# Altium schematic sheet LED.SchDoc
size A; SheetNumber: 1; SheetTotal: 1
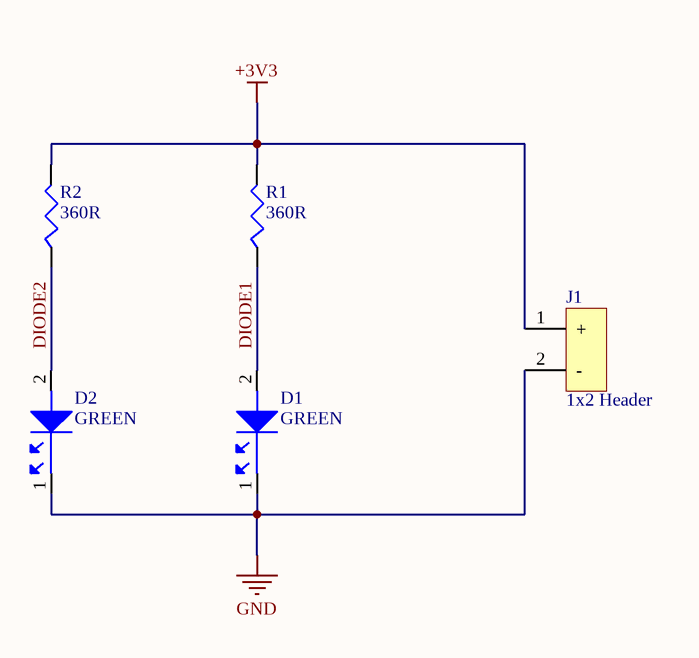
[diagram p0: LED.SchDoc]

## Parts
D1  GREEN  [LED0603G]
D2  GREEN  [LED0603G]
J1  1x2 Header  [HDR1X2]
R1  360R  [R0805]
R2  360R  [R0805]

## Nets
+3V3: J1.1(+) R1.2 R2.2
GND: D1.1 D2.1 J1.2(-)
DIODE1: D1.2 R1.1
DIODE2: D2.2 R2.1

## Library data of the parts
D1 D2 = LSM0603453V: LED GREEN CLEAR CHIP 0603 SMD; Manufacturer: VCC; Forward Current: 20mA; Forward Voltage: 3.4V; Luminous Intensity: 120mcd; Number of Circuits: 1; Power Dissipation: 60mW; Reverse Voltage: 5V; Shape: Rectangular; Viewing Angle: 110°; Wavelength: 576nm; Description: Led, Green, 120Mcd, 590Nm, Smd; Led Colo |Vcc/visual Communications Company LSM0603453V; Supplier: DigiKey; Supplier Part Number: LSM0603453VDKR-ND; Manufacturer Part Number: LSM0603453V; RoHS: Compliant; Category: LEDs; Stock: 43098; Pricing: 1=0.31, 10=0.212, 100=0.1493, 500=0.12076, 1000=0.11132, 2000=0.10329 (USD); Case/Package: 0603; Color: Green; Height: 600µm; Lifecycle Status: Production; Max Operating Temperature: 85°C; Min Operating Temperature: -40°C; Mounting Technology: Surface Mount; Number of Terminals: 2; REACH SVHC: Yes; Schedule B: 8541402000, 8541406050, 8541406050|8541406050|8541406050|8541406050|8541406050; Terminal Pitch: 1.3mm; ComponentLink1URL: https://datasheet.octopart.com:443/LSM0603453V-Visual-Communications-datasheet-166617523.pdf?src-supplier=RS+(Formerly+Allied+Electronics); ComponentLink1Description: https://datasheet.octopart.com:443/LSM0603453V-Visual-Communications-datasheet-166617523.pdf?src-supplier=RS+(Formerly+Allied+Electronics); ComponentLink2URL: https://datasheet.octopart.com:443/LSM0603453V-Visual-Communications-datasheet-120107411.pdf?src-supplier=VCC; ComponentLink2Description: https://datasheet.octopart.com:443/LSM0603453V-Visual-Communications-datasheet-120107411.pdf?src-supplier=VCC
J1 = 22-27-2021: CONN HEADER VERT 2POS 2.54MM; Manufacturer: Molex; Manufacturer Lifecycle Status: ACTIVE; Approvals: CSA, UL; Contact Resistance: 10mΩ; Current Rating: 4A; Dielectric Material: Polyamide; Gender: Male; Insulation Resistance: 1GΩ; Number of Circuits: 2; Plating: Tin; Plating Thickness: 2.54µm; Ratings: CSA; Voltage Rating: 500V; Voltage Rating (AC): 250V; Description: KK 254 Wire-to-Board Header, Vertical, with Friction Lock, 2 Circuits, Tin (Sn) Plating; Supplier: DigiKey; Supplier Part Number: WM4111-ND; Manufacturer Part Number: 22-27-2021; RoHS: Compliant; Category: Headers and Wire Housings; Stock: 123469; Pricing: 1=0.23, 10=0.194, 100=0.1645, 500=0.14678, 2850=0.1298, 5700=0.1236, 11400=0.1177 (USD); China RoHS: Compliant; Color: White; Contact Gender: Male; Contact Material: Brass; Contact Plating: Tin; Country of Origin: TH; Depth: 5.8mm; Export Control Classification Number (ECCN) Code: EAR99; Flammability Rating: UL94 V-0; Height: 12.05mm; Housing Color: Natural; Housing Material: Nylon; Harmonized Tariff Schedule (HTS) Code: 8536.69.40.40; Insulation Color: White; Introduction Date: 1994-12-01; Lead Free: Lead Free; Lead Pitch: 2.54mm; Length: 10.16mm; Lifecycle Status: Production; Material: Nylon; Max Current Rating: 4A; Max Operating Temperature: 75°C; Min Operating Temperature: 0°C; Mounting Technology: Through Hole; Number of Contacts: 2; Pins: 2; Number of Positions: 2; Number of Rows: 1; Orientation: Vertical; Pitch: 2.54mm; Radiation Hardening: No; REACH SVHC: Yes; Schedule B: 8536694040, 8536694040|8536694040|8536694040|8536694040|8536694040|8536694040|8536694040|8536694040|8536694040|8536694040|8536694040|8536694040|8536694040|8536694040|8536694040|8536694040|8536694040|8536694040|8536694040|8536694040|8536694040|8536694040|8536694040|85; Terminal Pitch: 2.54mm; Termination: Solder; Voltage Rating (DC): 250V; Working Voltage: 250V; ComponentLink1URL: https://datasheet.octopart.com:443/22-27-2021-Molex-datasheet-81843831.pdf?src-supplier=Upverter; ComponentLink1Description: https://datasheet.octopart.com:443/22-27-2021-Molex-datasheet-81843831.pdf?src-supplier=Upverter; ComponentLink2URL: https://datasheet.octopart.com:443/22-27-2021-Molex-datasheet-10979409.pdf?src-supplier=Molex; ComponentLink2Description: https://datasheet.octopart.com:443/22-27-2021-Molex-datasheet-10979409.pdf?src-supplier=Molex; ComponentLink3URL: https://datasheet.octopart.com:443/02227-2021-Molex-datasheet-13784872.pdf?src-supplier=Molex; ComponentLink3Description: https://datasheet.octopart.com:443/02227-2021-Molex-datasheet-13784872.pdf?src-supplier=Molex; ComponentLink4URL: https://datasheet.octopart.com:443/22-27-2021-Molex-datasheet-5315839.pdf?src-supplier=Future+Electronics; ComponentLink4Description: https://datasheet.octopart.com:443/22-27-2021-Molex-datasheet-5315839.pdf?src-supplier=Future+Electronics; ComponentLink5URL: https://datasheet.octopart.com:443/22272021-Molex-datasheet-137316104.pdf?src-supplier=Future+Electronics; ComponentLink5Description: https://datasheet.octopart.com:443/22272021-Molex-datasheet-137316104.pdf?src-supplier=Future+Electronics; ComponentLink6URL: https://datasheet.octopart.com:443/22-27-2021-Molex-datasheet-193085717.pdf?src-supplier=JRH+Electronics; ComponentLink6Description: https://datasheet.octopart.com:443/22-27-2021-Molex-datasheet-193085717.pdf?src-supplier=JRH+Electronics; ComponentLink7URL: https://datasheet.octopart.com:443/22-27-2021-Molex-datasheet-154747145.pdf?src-supplier=Master+Electronics; ComponentLink7Description: https://datasheet.octopart.com:443/22-27-2021-Molex-datasheet-154747145.pdf?src-supplier=Master+Electronics; ComponentLink8URL: https://datasheet.octopart.com:443/22-27-2021-Molex-datasheet-101581847.pdf?src-supplier=Farnell; ComponentLink8Description: https://datasheet.octopart.com:443/22-27-2021-Molex-datasheet-101581847.pdf?src-supplier=Farnell; ComponentLink9URL: https://datasheet.octopart.com:443/02227-2021-Molex-datasheet-14711101.pdf?src-supplier=Farnell; ComponentLink9Description: https://datasheet.octopart.com:443/02227-2021-Molex-datasheet-14711101.pdf?src-supplier=Farnell; ComponentLink10URL: https://datasheet.octopart.com:443/22-27-2021-Molex-datasheet-506551.pdf?src-supplier=Farnell; ComponentLink10Description: https://datasheet.octopart.com:443/22-27-2021-Molex-datasheet-506551.pdf?src-supplier=Farnell; ComponentLink11URL: https://datasheet.octopart.com:443/22-27-2021-Molex-datasheet-21538535.pdf?src-supplier=Newark; ComponentLink11Description: https://datasheet.octopart.com:443/22-27-2021-Molex-datasheet-21538535.pdf?src-supplier=Newark; ComponentLink12URL: https://datasheet.octopart.com:443/22-27-2021-Molex-datasheet-38329585.pdf?src-supplier=Newark; ComponentLink12Description: https://datasheet.octopart.com:443/22-27-2021-Molex-datasheet-38329585.pdf?src-supplier=Newark; ComponentLink13URL: https://datasheet.octopart.com:443/22-27-2021-Molex-datasheet-33021744.pdf?src-supplier=Newark; ComponentLink13Description: https://datasheet.octopart.com:443/22-27-2021-Molex-datasheet-33021744.pdf?src-supplier=Newark; ComponentLink14URL: https://datasheet.octopart.com:443/22-27-2021-Molex-datasheet-33002331.pdf?src-supplier=Newark; ComponentLink14Description: https://datasheet.octopart.com:443/22-27-2021-Molex-datasheet-33002331.pdf?src-supplier=Newark; ComponentLink15URL: https://datasheet.octopart.com:443/02227-2021-Molex-datasheet-21206939.pdf?src-supplier=Newark; ComponentLink15Description: https://datasheet.octopart.com:443/02227-2021-Molex-datasheet-21206939.pdf?src-supplier=Newark; ComponentLink16URL: https://datasheet.octopart.com:443/22-27-2021-Molex-datasheet-604178.pdf?src-supplier=element14+APAC; ComponentLink16Description: https://datasheet.octopart.com:443/22-27-2021-Molex-datasheet-604178.pdf?src-supplier=element14+APAC; ComponentLink17URL: https://datasheet.octopart.com:443/0022272021-Molex-datasheet-164461543.pdf?src-supplier=Sager+Electronics; ComponentLink17Description: https://datasheet.octopart.com:443/0022272021-Molex-datasheet-164461543.pdf?src-supplier=Sager+Electronics; ComponentLink18URL: https://datasheet.octopart.com:443/22-27-2021-Molex-datasheet-158567618.pdf?src-supplier=RS+(Formerly+Allied+Electronics); ComponentLink18Description: https://datasheet.octopart.com:443/22-27-2021-Molex-datasheet-158567618.pdf?src-supplier=RS+(Formerly+Allied+Electronics); ComponentLink19URL: https://datasheet.octopart.com:443/22-27-2021-Molex-datasheet-140181058.pdf?src-supplier=RS+(Formerly+Allied+Electronics); ComponentLink19Description: https://datasheet.octopart.com:443/22-27-2021-Molex-datasheet-140181058.pdf?src-supplier=RS+(Formerly+Allied+Electronics); ComponentLink20URL: https://datasheet.octopart.com:443/22-27-2021-Molex-datasheet-120145351.pdf?src-supplier=RS+(Formerly+Allied+Electronics); ComponentLink20Description: https://datasheet.octopart.com:443/22-27-2021-Molex-datasheet-120145351.pdf?src-supplier=RS+(Formerly+Allied+Electronics); ComponentLink21URL: https://datasheet.octopart.com:443/22-27-2021-Molex-datasheet-9995492.pdf?src-supplier=RS+(Formerly+Allied+Electronics); ComponentLink21Description: https://datasheet.octopart.com:443/22-27-2021-Molex-datasheet-9995492.pdf?src-supplier=RS+(Formerly+Allied+Electronics); ComponentLink22URL: https://datasheet.octopart.com:443/22-27-2021-Molex-datasheet-155977274.pdf?src-supplier=SOS+electronic; ComponentLink22Description: https://datasheet.octopart.com:443/22-27-2021-Molex-datasheet-155977274.pdf?src-supplier=SOS+electronic; ComponentLink23URL: https://datasheet.octopart.com:443/22-27-2021-Molex-datasheet-62103479.pdf?src-supplier=Electro+Sonic; ComponentLink23Description: https://datasheet.octopart.com:443/22-27-2021-Molex-datasheet-62103479.pdf?src-supplier=Electro+Sonic; ComponentLink24URL: https://datasheet.octopart.com:443/22-27-2021-Molex-datasheet-37168867.pdf?src-supplier=Electro+Sonic; ComponentLink24Description: https://datasheet.octopart.com:443/22-27-2021-Molex-datasheet-37168867.pdf?src-supplier=Electro+Sonic; ComponentLink25URL: https://datasheet.octopart.com:443/22-27-2021-Molex-datasheet-151821780.pdf?src-supplier=Toby+Electronics; ComponentLink25Description: https://datasheet.octopart.com:443/22-27-2021-Molex-datasheet-151821780.pdf?src-supplier=Toby+Electronics; ComponentLink26URL: https://datasheet.octopart.com:443/22-27-2021-Molex-datasheet-124775.pdf?src-supplier=DigiKey; ComponentLink26Description: https://datasheet.octopart.com:443/22-27-2021-Molex-datasheet-124775.pdf?src-supplier=DigiKey; ComponentLink27URL: https://datasheet.octopart.com:443/22-27-2021-Molex-datasheet-7627818.pdf?src-supplier=Jameco+(USA); ComponentLink27Description: https://datasheet.octopart.com:443/22-27-2021-Molex-datasheet-7627818.pdf?src-supplier=Jameco+(USA); ComponentLink28URL: https://datasheet.octopart.com:443/22-27-2021-Molex-datasheet-17586671.pdf?src-supplier=TME; ComponentLink28Description: https://datasheet.octopart.com:443/22-27-2021-Molex-datasheet-17586671.pdf?src-supplier=TME; ComponentLink29URL: http://sigma.octopart.com:80/16297726/rohs_statement/Molex-02227-2021.pdf?src-supplier=Compliance+Statements; ComponentLink29Description: http://sigma.octopart.com:80/16297726/rohs_statement/Molex-02227-2021.pdf?src-supplier=Compliance+Statements; ComponentLink30URL: http://sigma.octopart.com:80/reach_statement/Molex-company-74.pdf?src-supplier=Compliance+Statements; ComponentLink30Description: http://sigma.octopart.com:80/reach_statement/Molex-company-74.pdf?src-supplier=Compliance+Statements; ComponentLink31URL: http://sigma.octopart.com:80/rohs_statement/Molex-company-73.pdf?src-supplier=Compliance+Statements; ComponentLink31Description: http://sigma.octopart.com:80/rohs_statement/Molex-company-73.pdf?src-supplier=Compliance+Statements; ComponentLink32URL: http://sigma.octopart.com:80/conflict_mineral_statement/Molex-company-72.pdf?src-supplier=Compliance+Statements; ComponentLink32Description: http://sigma.octopart.com:80/conflict_mineral_statement/Molex-company-72.pdf?src-supplier=Compliance+Statements
R1 R2 = AC0805FR-07360RL: RES SMD 360 OHM 1% 1/8W 0805; Manufacturer: Yageo Group; Max Power Dissipation: 125mW; Value: 360Ω; Temperature Coefficient: 100ppm/°C; Voltage Rating: 150V; Description: Res Thick Film 0805 360 Ohm 1% 0.125W(1/8W) ±100ppm/C Pad SMD Automotive T/R; Supplier: DigiKey; Supplier Part Number: 13-AC0805FR-07360RLCT-ND; Manufacturer Part Number: AC0805FR-07360RL; RoHS: Compliant; Category: Chip SMD Resistors; Stock: 4894; Pricing: 1=0.1, 10=0.037, 25=0.028, 50=0.0228, 100=0.0188, 250=0.01484, 500=0.0126, 1000=0.01083, 5000=0.00757, 10000=0.00681, 15000=0.00644, 25000=0.00604, 35000=0.00581, 50000=0.00559 (USD); Case/Package: 0805; China RoHS: Non-Compliant; Composition: Thick Film; Depth: 1.25mm; Features: Automotive AEC-Q200, Moisture Resistant; Height: 500µm; Length: 2mm; Lifecycle Status: Production; Max Operating Temperature: 155°C; Military Standard: Not; Min Operating Temperature: -55°C; Mounting Technology: Surface Mount; Number of Terminals: 2; Number of Terminations: 2; Power Rating: 125mW; Ratings: AEC-Q200; REACH SVHC: Yes; Tolerance: 1%; Width: 1.25mm; Working Voltage: 150V; ComponentLink1URL: https://datasheet.octopart.com:443/AC0805FR-07360RL-Yageo-datasheet-182189377.pdf?src-supplier=IHS; ComponentLink1Description: https://datasheet.octopart.com:443/AC0805FR-07360RL-Yageo-datasheet-182189377.pdf?src-supplier=IHS; ComponentLink2URL: https://datasheet.octopart.com:443/AC0805FR-07360RL-Yageo-datasheet-83209224.pdf?src-supplier=Upverter; ComponentLink2Description: https://datasheet.octopart.com:443/AC0805FR-07360RL-Yageo-datasheet-83209224.pdf?src-supplier=Upverter; ComponentLink3URL: https://datasheet.octopart.com:443/AC0805FR-07360RL-Yageo-datasheet-178509465.pdf?src-supplier=Farnell; ComponentLink3Description: https://datasheet.octopart.com:443/AC0805FR-07360RL-Yageo-datasheet-178509465.pdf?src-supplier=Farnell; ComponentLink4URL: https://datasheet.octopart.com/AC0805FR-07360RL-Yageo-datasheet-12512238.pdf; ComponentLink4Description: https://datasheet.octopart.com/AC0805FR-07360RL-Yageo-datasheet-12512238.pdf; ComponentLink5URL: http://sigma.octopart.com:80/conflict_mineral_statement/Yageo-company-3.pdf?src-supplier=Compliance+Statements; ComponentLink5Description: http://sigma.octopart.com:80/conflict_mineral_statement/Yageo-company-3.pdf?src-supplier=Compliance+Statements; ComponentLink6URL: http://sigma.octopart.com:80/rohs_statement/Yageo-company-2.pdf?src-supplier=Compliance+Statements; ComponentLink6Description: http://sigma.octopart.com:80/rohs_statement/Yageo-company-2.pdf?src-supplier=Compliance+Statements